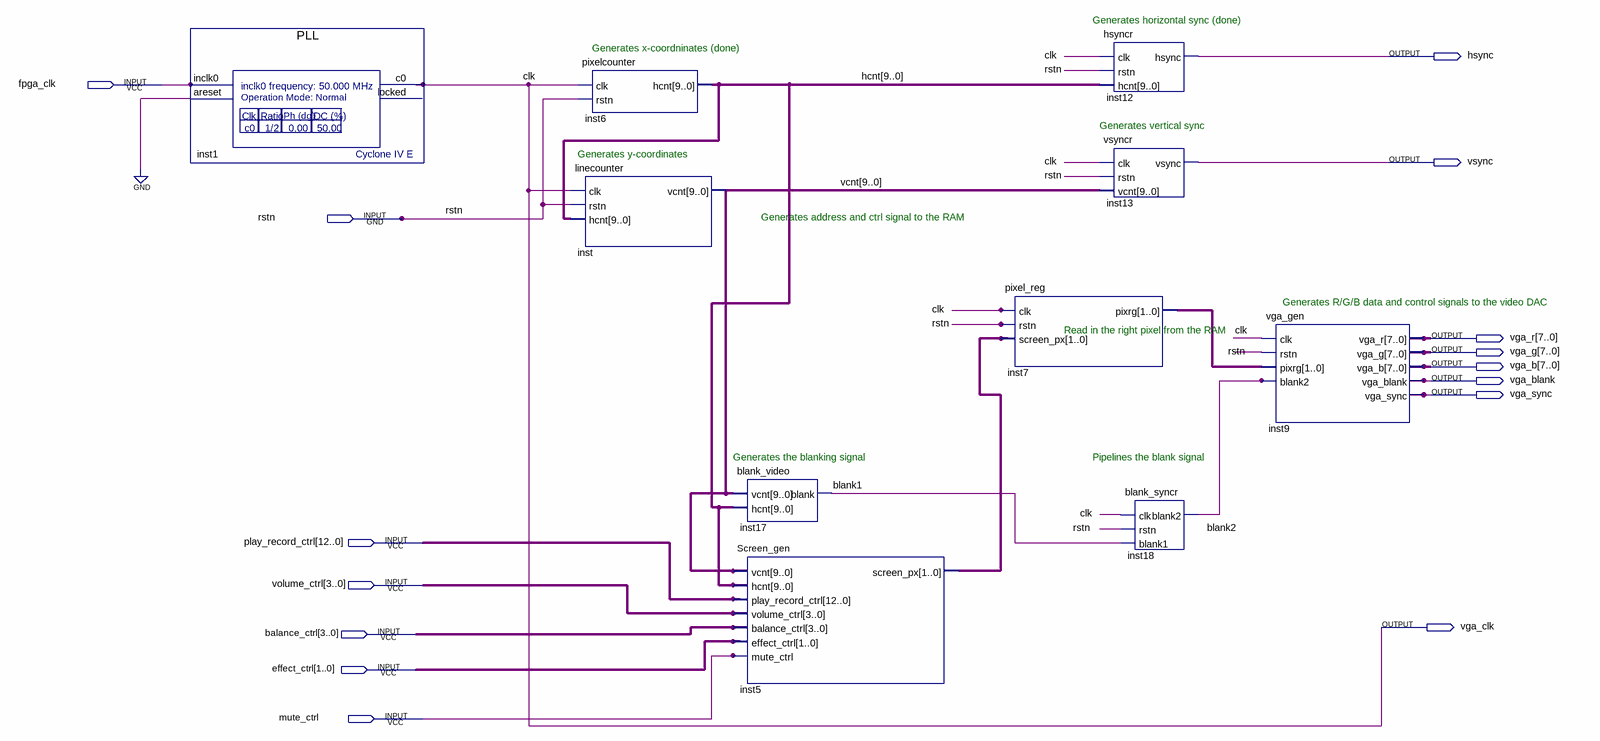
[diagram p0: schematic sheet]
// Quartus schematic VGA_contr.bdf as structural Verilog: 10 symbols, 15 pins
module VGA_contr (
  input  fpga_clk,
  input  rstn,
  input  [12:0] play_record_ctrl,
  input  [3:0] volume_ctrl,
  input  [3:0] balance_ctrl,
  input  [1:0] effect_ctrl,
  input  mute_ctrl,
  output hsync,
  output vsync,
  output [7:0] vga_r,
  output [7:0] vga_g,
  output [7:0] vga_b,
  output vga_blank,
  output vga_sync,
  output vga_clk
);

  wire blank1, blank2;
  wire [1:0] inst5_screen_px, inst7_pixrg;
  wire [9:0] hcnt, vcnt;

  PLL inst1 (.inclk0(fpga_clk), .areset(1'b0), .c0(vga_clk));  // open: locked
  pixelcounter inst6 (.clk(vga_clk), .rstn(rstn), .hcnt(hcnt));
  linecounter inst (.clk(vga_clk), .rstn(rstn), .hcnt(hcnt), .vcnt(vcnt));
  blank_video inst17 (.vcnt(vcnt), .hcnt(hcnt), .blank(blank1));
  Screen_gen inst5 (
    .vcnt(vcnt), .hcnt(hcnt), .play_record_ctrl(play_record_ctrl), .volume_ctrl(volume_ctrl),
    .balance_ctrl(balance_ctrl), .effect_ctrl(effect_ctrl), .mute_ctrl(mute_ctrl), .screen_px(inst5_screen_px));
  pixel_reg inst7 (.clk(vga_clk), .rstn(rstn), .screen_px(inst5_screen_px), .pixrg(inst7_pixrg));
  hsyncr inst12 (.clk(vga_clk), .hcnt(hcnt), .rstn(rstn), .hsync(hsync));
  vsyncr inst13 (.clk(vga_clk), .vcnt(vcnt), .rstn(rstn), .vsync(vsync));
  blank_syncr inst18 (.clk(vga_clk), .rstn(rstn), .blank1(blank1), .blank2(blank2));
  vga_gen inst9 (
    .clk(vga_clk), .rstn(rstn), .pixrg(inst7_pixrg), .blank2(blank2), .vga_r(vga_r), .vga_g(vga_g),
    .vga_b(vga_b), .vga_blank(vga_blank), .vga_sync(vga_sync));

  // Other names for the same wires on the sheet: clk = vga_clk

  // Notes on the sheet:
  //   Generates horizontal sync (done)
  //   Generates x-coordninates (done)
  //   Generates vertical sync
  //   Generates y-coordinates
  //   Generates address and ctrl signal to the RAM
  //   Generates R/G/B data and control signals to the video DAC
  //   Read in the right pixel from the RAM
  //   Generates the blanking signal
  //   Pipelines the blank signal
endmodule
